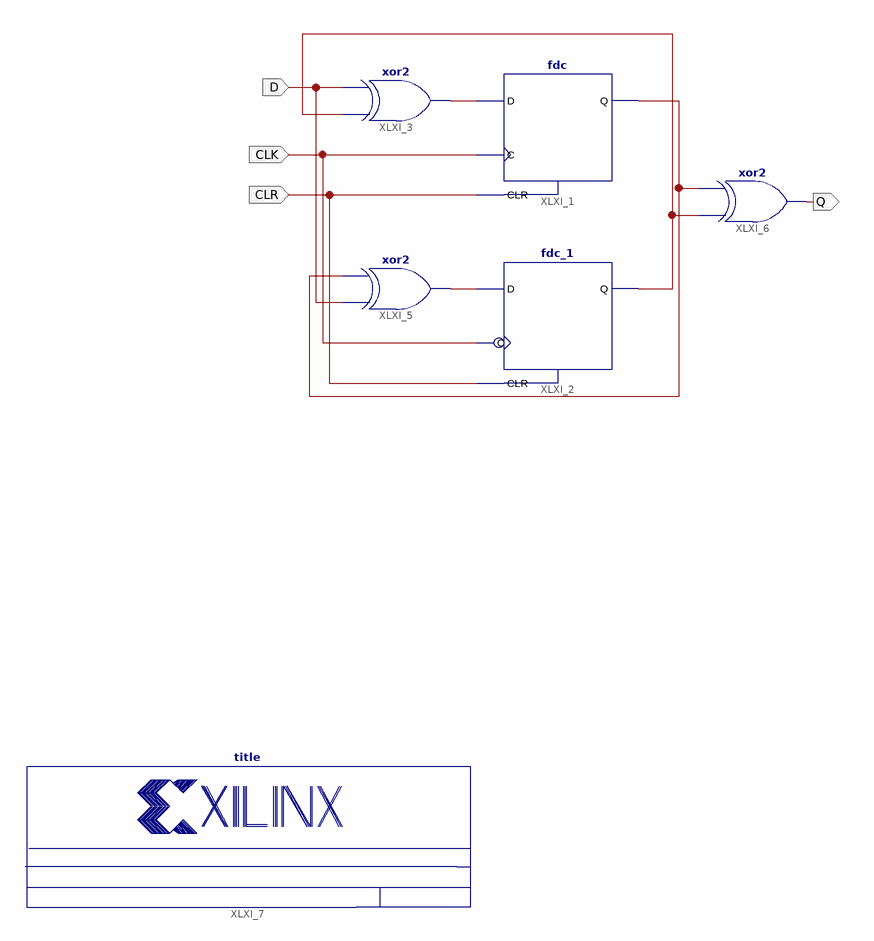
[diagram p0: schematic sheet 1]
// Xilinx ISE schematic DET_FF.sch (spartan3e) as structural Verilog: 6 symbols, 4 ports
module DET_FF (
  input  CLK,
  input  CLR,
  input  D,
  output Q
);

  wire XLXN_3, XLXN_4, XLXN_6, XLXN_11;

  fdc XLXI_1 (.C(CLK), .CLR(CLR), .D(XLXN_3), .Q(XLXN_6));
  fdc_1 XLXI_2 (.C(CLK), .CLR(CLR), .D(XLXN_4), .Q(XLXN_11));
  xor XLXI_3 (XLXN_3, XLXN_11, D);
  xor XLXI_5 (XLXN_4, D, XLXN_6);
  xor XLXI_6 (Q, XLXN_11, XLXN_6);
  title #(.NameFieldText("Karthik Vippala")) XLXI_7 ();
endmodule
